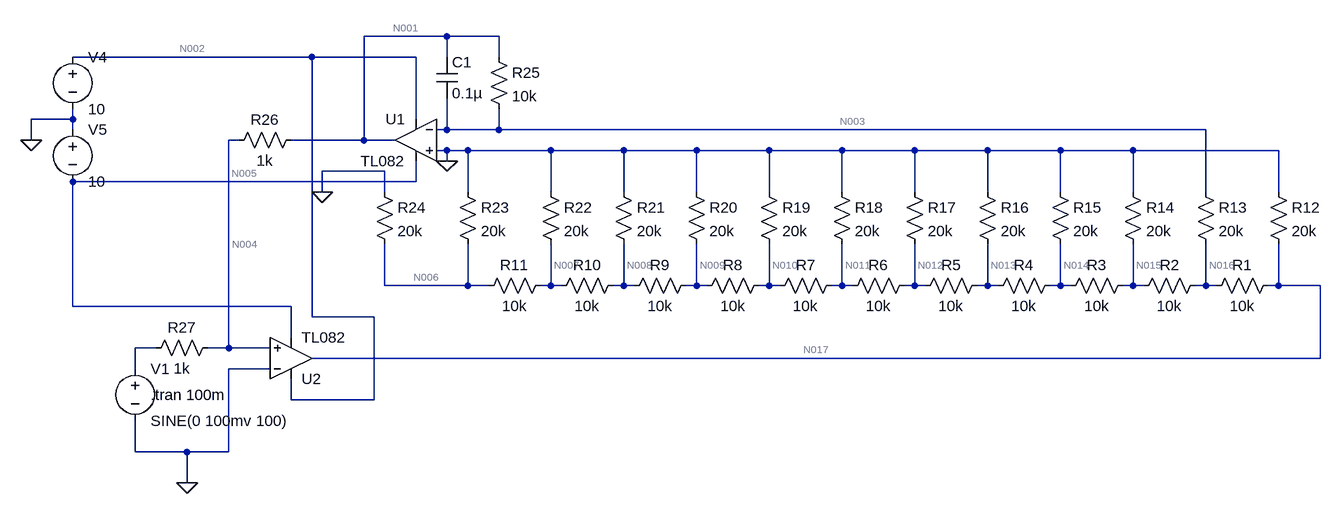
[diagram p0: schematic sxematic.asc]
* sxematic.asc
R2 N016 N015 10k
R3 N015 N014 10k
R4 N014 N013 10k
R5 N013 N012 10k
R1 N017 N016 10k
R6 N012 N011 10k
R7 N011 N010 10k
R8 N010 N009 10k
R9 N009 N008 10k
R10 N008 N007 10k
R11 N007 N006 10k
R18 0 N011 20k
R19 0 N010 20k
R20 0 N009 20k
R21 0 N008 20k
R22 0 N007 20k
R23 0 N006 20k
R24 0 N006 20k
R25 N001 N003 10k
C1 N001 N003 0.1µ
R26 N001 N004 1k
R27 N004 N018 1k
R17 0 N012 20k
R16 0 N013 20k
R15 0 N014 20k
R14 0 N015 20k
R13 N003 N016 20k
R12 0 N017 20k
V1 N018 0 SINE(0 100mv 100)
V4 N002 0 10
V5 0 N005 10
* U1: TL082 (symbol TL082 not available, pins judged from their places): In+=0 In-=N003 V+=N002 V-=N005 OUT=N001
* U2: TL082 (symbol TL082 not available, pins judged from their places): In+=N004 In-=0 V+=N002 V-=N005 OUT=N017
.tran 100m
.backanno
.end

* Results of the author's LTspice run, read from the files saved beside the schematic
* Operating Point, zero values left out:
*   V(n016) = 77.51 µV
*   V(n015) = 38.76 µV
*   V(n014) = 19.38 µV
*   V(n013) = 9.689 µV
*   V(n012) = 4.845 µV
*   V(n017) = 149.5 µV
*   V(n011) = 2.422 µV
*   V(n010) = 1.211 µV
*   V(n009) = 605.6 nV
*   V(n008) = 302.8 nV
*   V(n007) = 151.4 nV
*   V(n006) = 75.7 nV
*   V(n001) = -21.9 µV
*   V(n003) = 10.97 µV
*   V(n004) = -10.97 µV
*   V(n002) = 10 V
*   V(n005) = -10 V
*   I(R12) = -7.477 nA
*   I(R13) = -3.327 nA
*   I(R14) = -1.938 nA
*   I(R15) = -968.9 pA
*   I(R16) = -484.5 pA
*   I(R17) = -242.2 pA
*   I(R27) = -10.97 nA
*   I(R26) = -10.93 nA
*   I(R25) = -3.287 nA
*   I(R24) = -3.785 pA
*   I(R23) = -3.785 pA
*   I(R22) = -7.57 pA
*   I(R21) = -15.14 pA
*   I(R20) = -30.28 pA
*   I(R19) = -60.56 pA
*   I(R18) = -121.1 pA
*   I(R11) = 7.57 pA
*   I(R10) = 15.14 pA
*   I(R9) = 30.28 pA
*   I(R8) = 60.56 pA
*   I(R7) = 121.1 pA
*   I(R6) = 242.2 pA
*   I(R1) = 7.203 nA
*   I(R5) = 484.5 pA
*   I(R4) = 968.9 pA
*   I(R3) = 1.938 nA
*   I(R2) = 3.876 nA
*   I(V5) = -19.06 mA
*   I(V4) = -19.06 mA
*   I(V1) = -10.97 nA
*   Ix(u1:1) = 40.05 pA
*   Ix(u1:2) = 40.05 pA
*   Ix(u1:3) = 9.528 mA
*   Ix(u1:4) = -9.528 mA
*   Ix(u1:5) = 14.22 nA
*   Ix(u2:1) = 40.05 pA
*   Ix(u2:2) = 40.05 pA
*   Ix(u2:3) = 9.528 mA
*   Ix(u2:4) = -9.528 mA
*   Ix(u2:5) = -14.68 nA
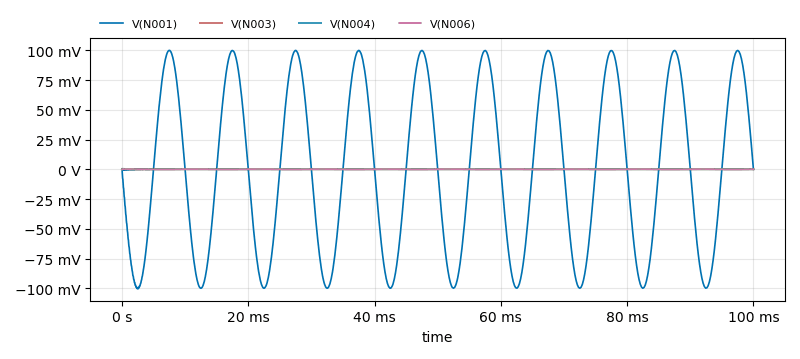
[diagram p1: Transient Analysis of sxematic.asc, plotted from the saved traces]
* Transient Analysis, 1 run:
*   V(N001): min -100.4 mV, max 99.96 mV, average -25.07 µV, rms 70.66 mV, last 3.668 µV
*   V(N003): min 7.146 µV, max 17.8 µV, average 10.97 µV, rms 11.24 µV, last 14.36 µV
*   V(N004): min -548.2 µV, max 569.4 µV, average -10.86 µV, rms 46.35 µV, last 1.814 µV
*   V(N006): min -236.7 µV, max 289.5 µV, average 55.68 nV, rms 163.2 µV, last 122.8 µV